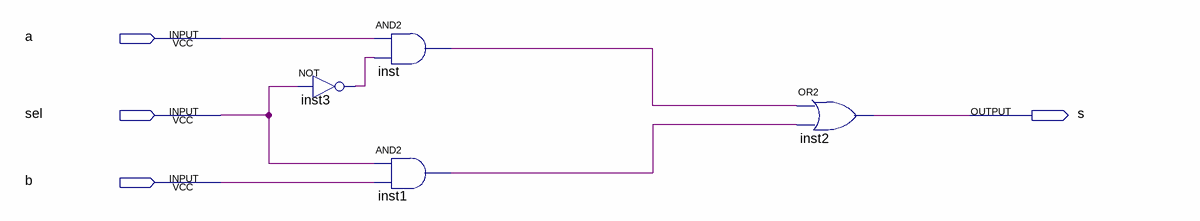
[diagram p0: schematic sheet]
// Quartus schematic mux2x1.bdf as structural Verilog: 4 symbols, 4 pins
module mux2x1 (
  input  a,
  input  sel,
  input  b,
  output s
);

  wire inst1_out, inst3_out, inst_out;

  not inst3 (inst3_out, sel);
  and inst (inst_out, a, inst3_out);
  and inst1 (inst1_out, sel, b);
  or inst2 (s, inst_out, inst1_out);
endmodule
